# EAGLE design thing-plus-carrier (EAGLE 9.6.2)
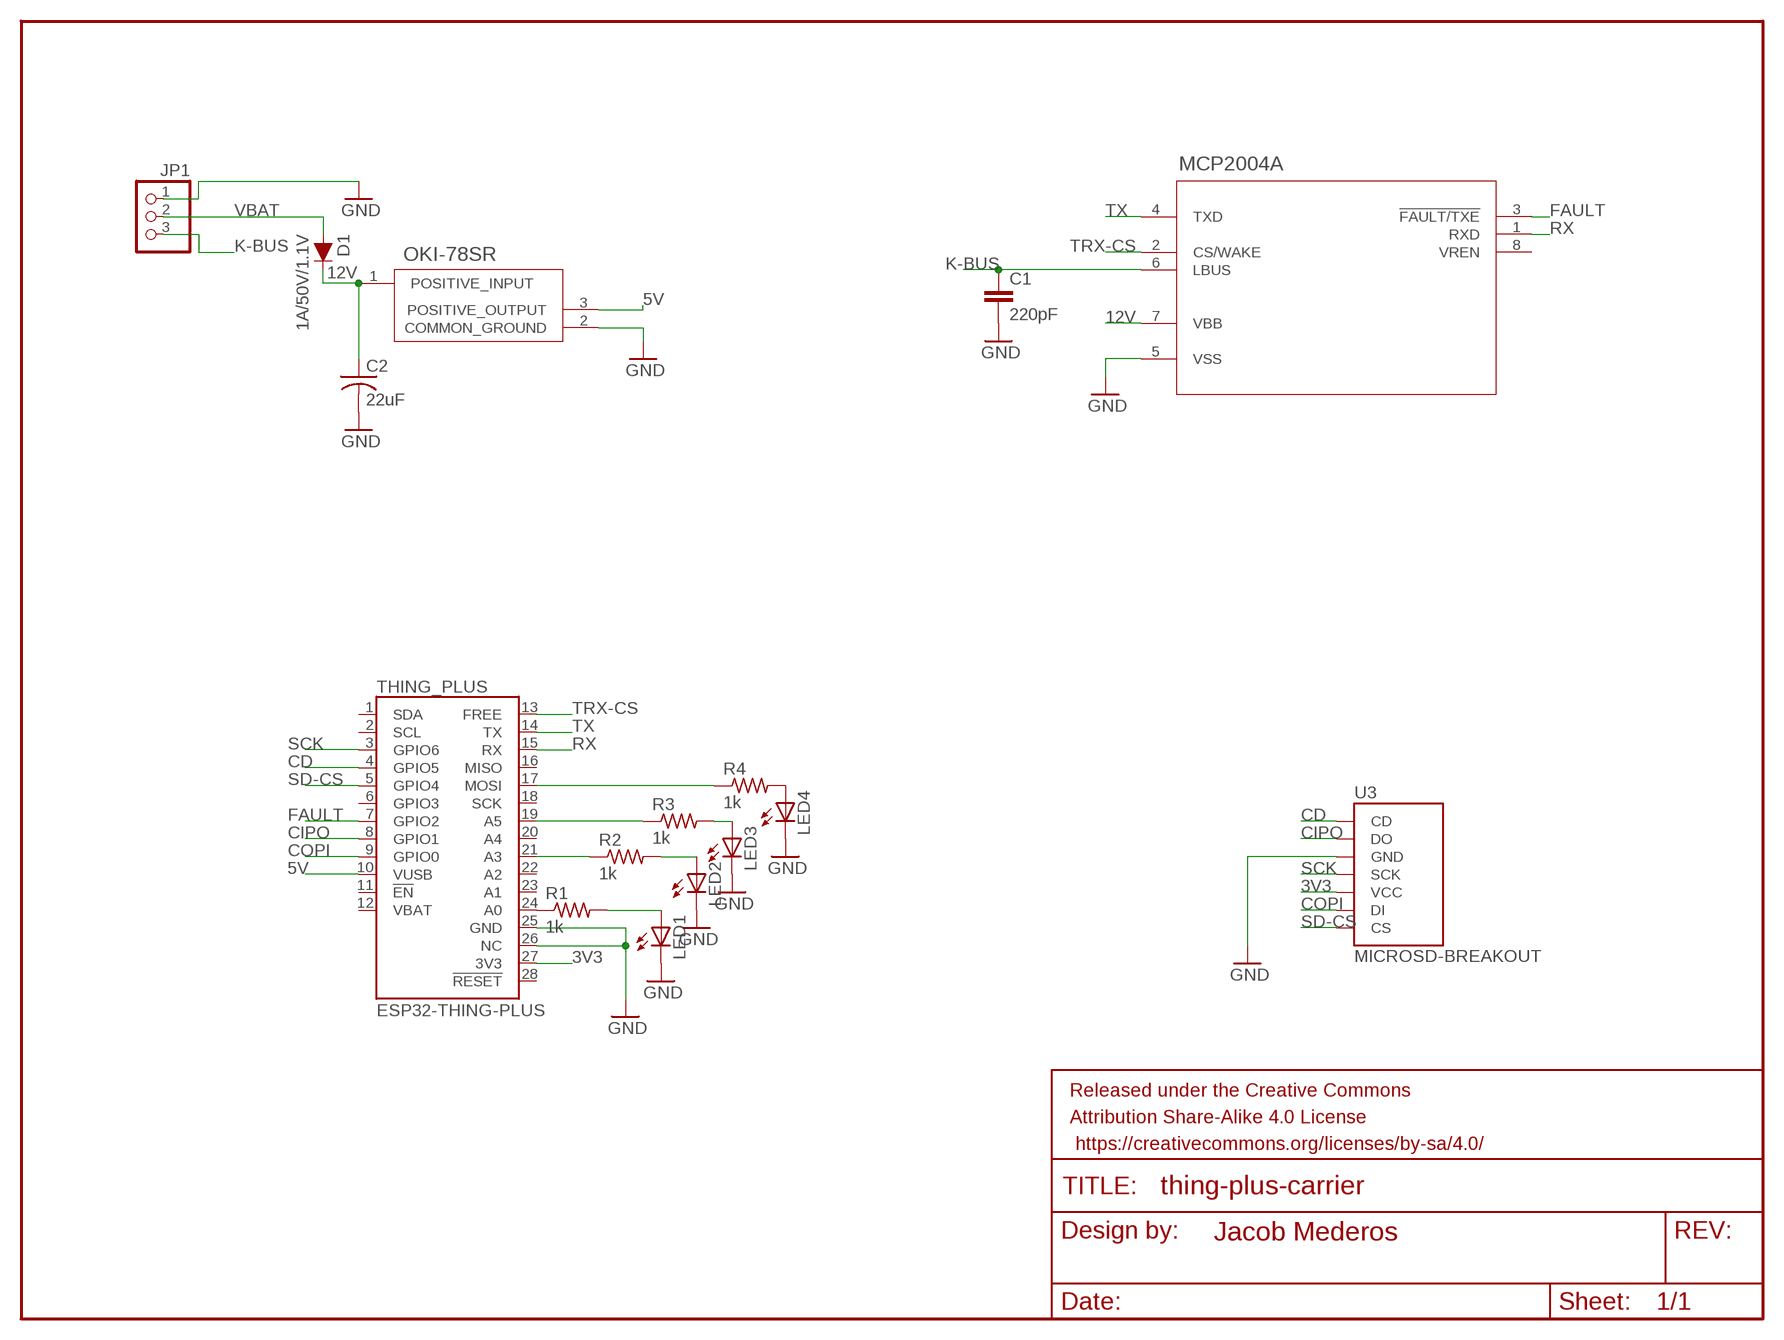
[diagram p0: schematic, sheet 1]

## Parts
C1  220pF  0.1UF-KIT-EZ-50V-20%  [CAP-PTH-SMALL-KIT]
C2  22uF  C-USC1206K  [C1206K]
D1  1A/50V/1.1V  DIODE-PTH  [DIODE-1N4001]
ESP32-THING-PLUS  THING_PLUS  [THING_PLUS]
FRAME1  FRAME-LETTERNO_PACKAGE  [DUMMY]
JP1  PINHD-1X3  [1X03]
LED1  LEDCHIPLED_0805  [CHIPLED_0805]
LED2  LEDCHIPLED_0805  [CHIPLED_0805]
LED3  LEDCHIPLED_0805  [CHIPLED_0805]
LED4  LEDCHIPLED_0805  [CHIPLED_0805]
MCP2004A  MCP2004A-E/SNSOIC8_4P9X3P9MC_MCH-M  [SOIC8_4P9X3P9MC_MCH-M]
OKI-78SR  OKI-78SR-5/1.5-W36H-C  [OKI-78SR-5/1.5-W36H-C_MUR]
R1  1k  R-US_R0805  [R0805]
R2  1k  R-US_R0805  [R0805]
R3  1k  R-US_R0805  [R0805]
R4  1k  R-US_R0805  [R0805]
U3  MICROSD-BREAKOUT  [MICROSD-BREAKOUT]

## Nets
3V3: ESP32-THING-PLUS.27(3V3) U3.VCC
5V: ESP32-THING-PLUS.10(VUSB) OKI-78SR.3(POSITIVE_OUTPUT)
12V: C2.1 D1.C MCP2004A.7(VBB) OKI-78SR.1(POSITIVE_INPUT)
CD: ESP32-THING-PLUS.4(GPIO5) U3.CD
CIPO: ESP32-THING-PLUS.8(GPIO1) U3.DO
COPI: ESP32-THING-PLUS.9(GPIO0) U3.DI
FAULT: ESP32-THING-PLUS.7(GPIO2) MCP2004A.3(!FAULT/TXE)
GND: C1.2 C2.2 ESP32-THING-PLUS.25(GND) ESP32-THING-PLUS.26(NC) JP1.1 LED1.C LED2.C LED3.C LED4.C MCP2004A.5(VSS) OKI-78SR.2(COMMON_GROUND) U3.GND
K-BUS: C1.1 JP1.3 MCP2004A.6(LBUS)
N$1: ESP32-THING-PLUS.19(A5) R3.1
N$2: ESP32-THING-PLUS.24(A0) R1.1
N$3: ESP32-THING-PLUS.21(A3) R2.1
N$4: ESP32-THING-PLUS.17(MOSI) R4.1
N$5: LED4.A R4.2
N$6: LED3.A R3.2
N$7: LED2.A R2.2
N$8: LED1.A R1.2
RX: ESP32-THING-PLUS.15(RX) MCP2004A.1(RXD)
SCK: ESP32-THING-PLUS.3(GPIO6) U3.SCK
SD-CS: ESP32-THING-PLUS.5(GPIO4) U3.CS
TRX-CS: ESP32-THING-PLUS.13(FREE) MCP2004A.2(CS/WAKE)
TX: ESP32-THING-PLUS.14(TX) MCP2004A.4(TXD)
VBAT: D1.A JP1.2
Unconnected: ESP32-THING-PLUS.1(SDA) ESP32-THING-PLUS.2(SCL) ESP32-THING-PLUS.6(GPIO3) ESP32-THING-PLUS.11(!EN) ESP32-THING-PLUS.12(VBAT) ESP32-THING-PLUS.16(MISO) ESP32-THING-PLUS.18(SCK) ESP32-THING-PLUS.20(A4) ESP32-THING-PLUS.22(A2) ESP32-THING-PLUS.23(A1) ESP32-THING-PLUS.28(!RESET) MCP2004A.8(VREN)

## Library data of the parts
C1 = SparkFun-Capacitors:0.1UF: 0.1µF ceramic capacitors A capacitor is a passive two-terminal electrical component used to store electrical energy temporarily in an electric field.; PROD_ID: CAP-08370; VALUE: 0.1uF
C2 = adafruit:C-US: CAPACITOR, American symbol
D1 = SparkFun-DiscreteSemi:DIODE: Diode These are standard reverse protection diodes and small signal diodes. SparkFun Products: SparkFun SparkPunk Sound Kit <https://www.sparkfun.com/products/11177> SparkFun ESP8266 Thing <https://www.sparkfun.com/products/13231>; PROD_ID: DIO-09176
ESP32-THING-PLUS = SparkFun-Boards:THING_PLUS
FRAME1 = SparkFun-Aesthetics:FRAME-LETTER: Schematic Frame - Letter Standard 8.5x11 US Letter frame; DESIGNER: Jacob Mederos; VERSION: v01
JP1 = kbus-feather-carrier-bom:PINHD-1X3: PIN HEADER
LED1-LED4 = adafruit:LED: LED OSRAM: - CHIPLED LG R971, LG N971, LY N971, LG Q971, LY Q971, LO R971, LY R971 LH N974, LH R974 LS Q976, LO Q976, LY Q976 LO Q996 - Hyper CHIPLED LW Q18S LB Q993, LB Q99A, LB R99A - SideLED LS A670, LO A670, LY A670, LG A670, LP A670 LB A673, LV A673, LT A673, LW A673 LH A674 LY A675 LS A676, LA A676, LO A676, LY A676, LW A676 LS A679, LY A679, LG A679 - Hyper Micro SIDELED® LS Y876, LA Y876, LO Y876, LY Y876 LT Y87S - SmartLED LW L88C, LW L88S LB L89C, LB L89S, LG L890 LS L89K, LO L89K, LY L89K LS L896, LA L896, LO L896, LY L896 - TOPLED LS T670, LO T670, LY T670, LG T670, LP T670 LSG T670, LSP T670, LSY T670, LOP T670, LYG T670 LG T671, LOG T671, LSG T671 LB T673, LV T673, LT T673, LW T673 LH T674 LS T676, LA T676, LO T676, LY T676, LB T676, LH T676, LSB T676, LW T676 LB T67C, LV T67C, LT T67C, LS T67K, LO T67K, LY T67K, LW E67C LS E67B, LA E67B, LO E67B, LY E67B, LB E67C, LV E67C, LT E67C LW T67C LS T679, LY T679, LG T679 LS T770, LO T770, LY T770, LG T770, LP T770 LB T773, LV T773, LT T773, LW T773 LH T774 LS E675, LA E675, LY E675, LS T675 LS T776, LA T776, LO T776, LY T776, LB T776 LHGB T686 LT T68C, LB T68C - Hyper Mini TOPLED® LB M676 - Mini TOPLED Santana® LG M470 LS M47K, LO M47K, LY M47K Source: http://www.osram.convergy.de/
MCP2004A = kbus-feather-carrier-bom:MCP2004A-E/SN; BUILT_BY: EMA_Jessica; COPYRIGHT: Copyright (C) 2018 Accelerated Designs. All rights reserved; MANUFACTURER_PART_NUMBER: MCP2004A-E/SN; SOURCELIBRARY: Microchip_2019-08-23_21; VENDOR: Microchip
OKI-78SR = kbus-feather-carrier-bom:OKI-78SR-5/1.5-W36H-C; BUILT_BY: EMA_Cory; COPYRIGHT: Copyright (C) 2018 Accelerated Designs. All rights reserved; MANUFACTURER_PART_NUMBER: OKI-78SR-5/1.5-W36H-C; SOURCELIBRARY: Murata_2020-01-23; VENDOR: Murata
R1-R4 = adafruit:R-US_: RESISTOR, American symbol
U3 = kbus-feather-carrier-bom:MICROSD-BREAKOUT

## Board
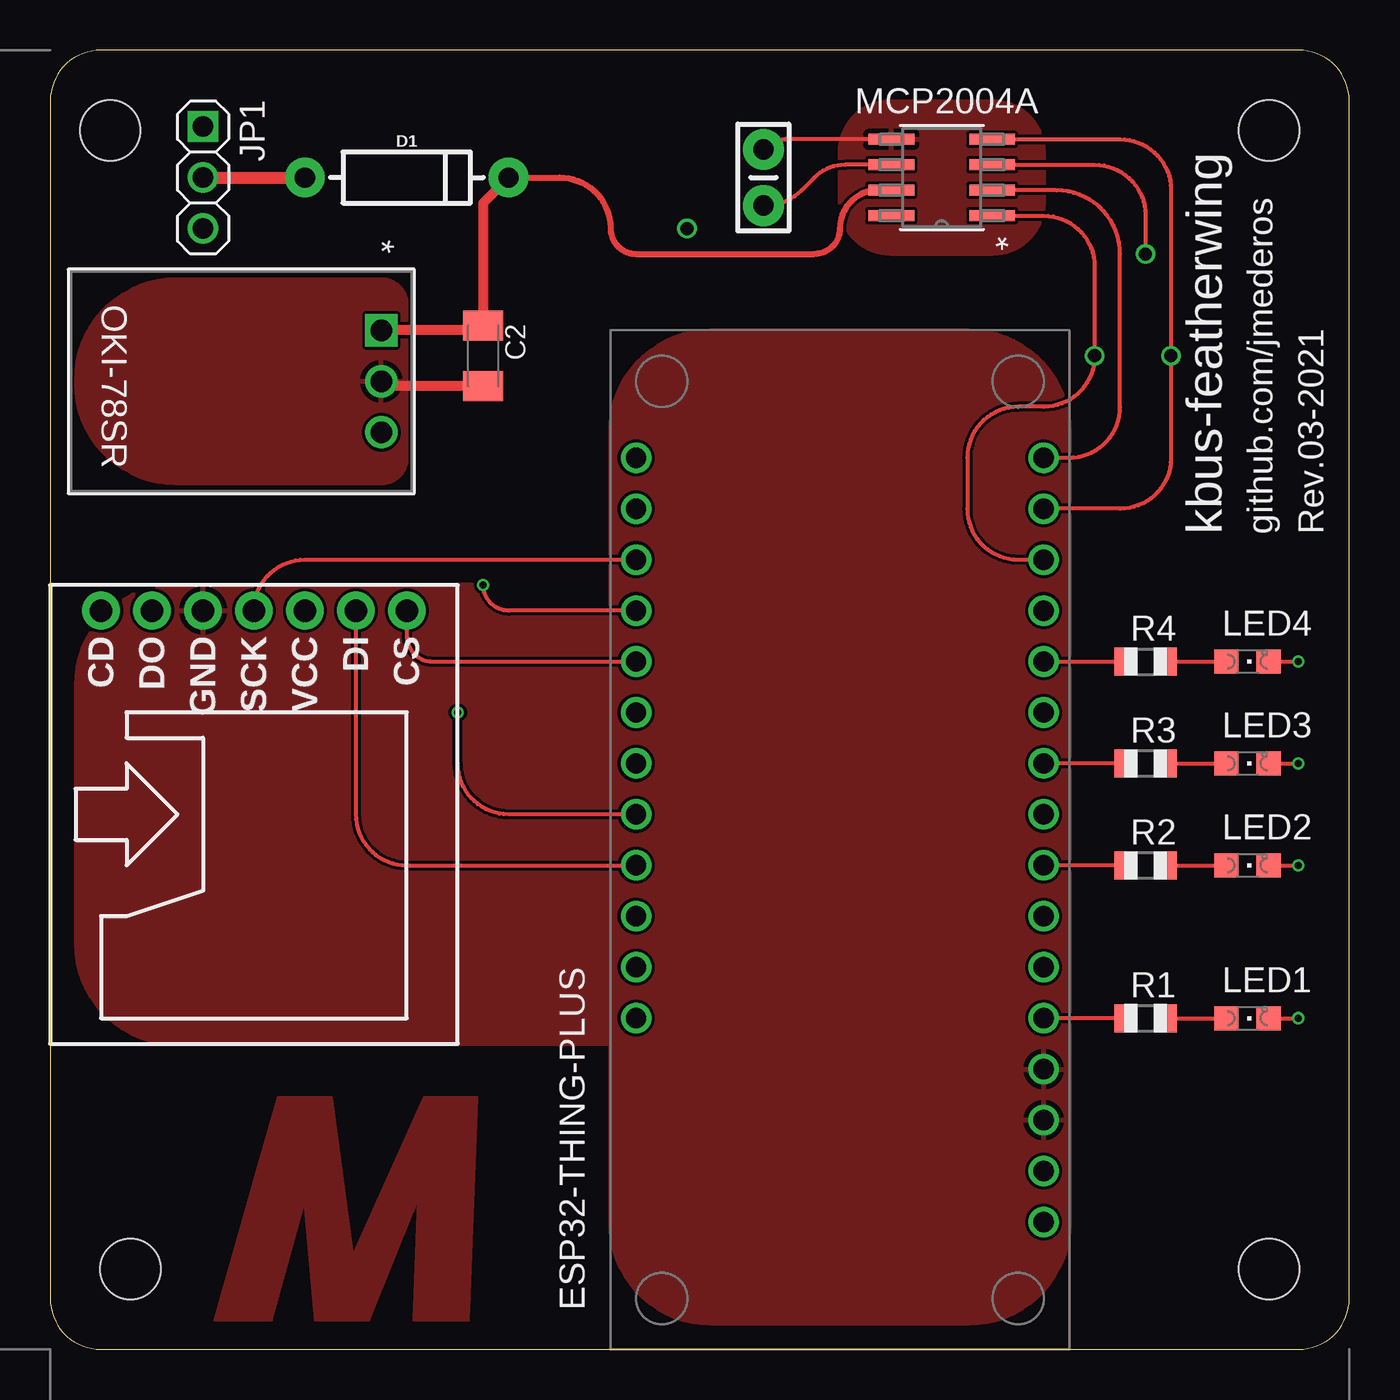
[diagram p1: board, top side]
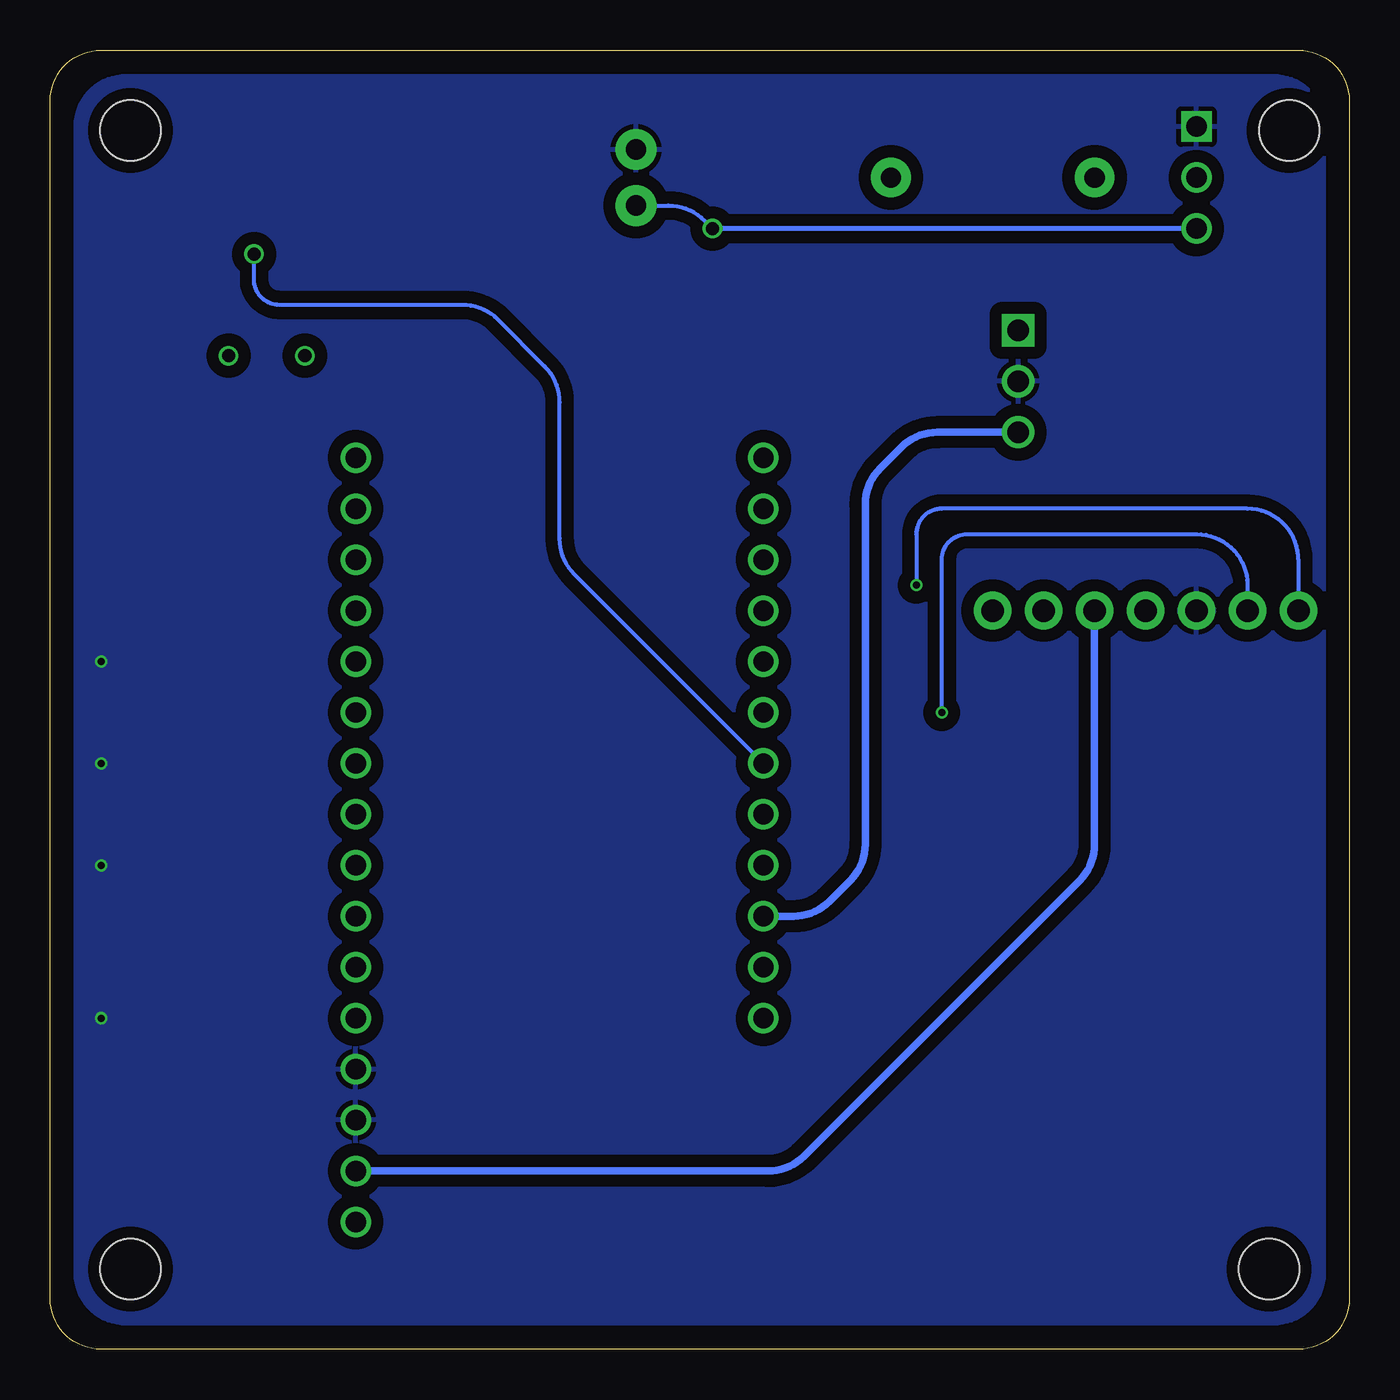
[diagram p2: board, bottom side, seen from below]

Size 64.77 x 64.77 mm. Coordinates in mm from the lower left corner, seen from the top.
Outline: 0,62.23 0,2.54 arc90 2.54,0 62.23,0 arc90 64.77,2.54 64.77,62.23 arc90 62.23,64.77 2.54,64.77 arc90 0,62.23
Copper layers (1*16): Top 0.035559375mm / dielectric 1.6mm / Bottom 0.035559375mm
Design rules "oshpark-2layer *": minimum track width 6mil, minimum drill 10mil, track to track 6mil, track to pad 6mil, pad to pad 6mil, via to via 6mil, smd to smd 6mil, copper to edge 15mil, drill to drill 6mil, minimum pad ring 5mil, minimum via ring 5mil, stop-mask expansion 2.5mil, vias tented up to drill 20mil, thermal gap 10mil
Holes 3 mm at 4,4 60.77,4 60.77,60.77 3,60.77

### Footprints (pad centres in the part's own frame; a part is rotated, then mirrored left to right if it is on the bottom)
CAP-PTH-SMALL-KIT = drill 1.016 pad 2.032: 1 -1.397,0; 2 1.397,0
C1206K = smd 1.5 x 2: 1 -1.5,0; 2 1.5,0
DIODE-1N4001 = drill 1 pad 1.981: A -5.08,0; C 5.08,0
THING_PLUS = drill 1.016: 1 -10.16,19.05; 2 -10.16,16.51; 3 -10.16,13.97; 4 -10.16,11.43; 5 -10.16,8.89; 6 -10.16,6.35; 7 -10.16,3.81; 8 -10.16,1.27; 9 -10.16,-1.27; 10 -10.16,-3.81; 11 -10.16,-6.35; 12 -10.16,-8.89; 13 10.16,19.05; 14 10.16,16.51; 15 10.16,13.97; 16 10.16,11.43; 17 10.16,8.89; 18 10.16,6.35; 19 10.16,3.81; 20 10.16,1.27; 21 10.16,-1.27; 22 10.16,-3.81; 23 10.16,-6.35; 24 10.16,-8.89; 25 10.16,-11.43; 26 10.16,-13.97; 27 10.16,-16.51; 28 10.16,-19.05
1X03 = drill 1.016 square: 1 -2.54,0 | drill 1.016: 2 0,0; 3 2.54,0
CHIPLED_0805 = smd 1.2 x 1.2: A 0,-1.05; C 0,1.05
SOIC8_4P9X3P9MC_MCH-M = smd 2.286 x 0.559: 1 -2.515,1.905; 2 -2.515,0.635; 3 -2.515,-0.635; 4 -2.515,-1.905; 5 2.515,-1.905; 6 2.515,-0.635; 7 2.515,0.635; 8 2.515,1.905
OKI-78SR-5/1.5-W36H-C_MUR = drill 1.067 pad 1.575 square: 1 0,0 | drill 1.067 pad 1.575: 2 2.54,0; 3 5.08,0
R0805 = smd 1.1 x 1.4: 1 -1,0; 2 1,0
MICROSD-BREAKOUT = drill 1.118 pad 1.88: CD 12.7,8.89; CS 12.7,-6.35; DI 12.7,-3.81; DO 12.7,6.35; GND 12.7,3.81; SCK 12.7,1.27; VCC 12.7,-1.27

### Placement (x,y rotation side)
C1  35.56,58.42 90 top
C2  21.59,49.53 270 top
D1  17.78,58.42 0 top
ESP32-THING-PLUS  39.37,25.4 0 top
FRAME1  -12.7,3.81 0 top  (outside the outline)
JP1  7.62,58.42 270 top
LED1  59.69,16.51 270 top
LED2  59.69,24.13 270 top
LED3  59.69,29.21 270 top
LED4  59.69,34.29 270 top
MCP2004A  44.45,58.42 180 top
OKI-78SR  16.51,50.8 270 top
R1  54.61,16.51 0 top
R2  54.61,24.13 0 top
R3  54.61,29.21 0 top
R4  54.61,34.29 0 top
U3  11.43,24.13 90 top

### Tracks (layer width: path | path; a pad name or v marks a point on that pad's centre or on a via)
3V3
  Bottom 0.381: U3.VCC 12.7,25.18 arc45 13.44,23.39 27.2,9.63 arc45 28.99,8.89 ESP32-THING-PLUS.27
5V
  Bottom 0.381: OKI-78SR.3 20.54,45.72 arc-45 22.33,44.98 23.39,43.92 arc-45 24.13,42.13 24.13,25.18 arc45 24.87,23.39 25.93,22.33 arc45 27.72,21.59 ESP32-THING-PLUS.10
12V
  Top 0.203: MCP2004A.7 41.27,57.78
  Top 0.305: 41.27,57.78 arc90 39.37,55.88 arc-90 38.1,54.61 29.21,54.61 arc-90 27.94,55.88 arc90 25.4,58.42 D1.C
  Top 0.406: C2.1 arc-90 21.48,50.91
  Top 0.508: D1.C 21.59,57.15 C2.1 | C2.1 21.48,50.91 | C2.1 21.36,50.8 OKI-78SR.1
CD  (via drill 0.35)
  Top 0.203: ESP32-THING-PLUS.4 22.86,36.83 arc-90 v21.59,38.1
  Bottom 0.203: U3.CD 2.54,39.37 arc-90 5.08,41.91 20.32,41.91 arc-90 21.59,40.64 v21.59,38.1
CIPO  (via drill 0.35)
  Top 0.203: ESP32-THING-PLUS.8 22.86,26.67 arc-90 20.32,29.21 v20.32,31.75
  Bottom 0.203: v20.32,31.75 20.32,39.37 arc90 19.05,40.64 7.62,40.64 arc90 5.08,38.1 U3.DO
COPI
  Top 0.203: ESP32-THING-PLUS.9 17.78,24.13 arc-90 15.24,26.67 U3.DI
FAULT  (via drill 0.65)
  Top 0.203: MCP2004A.3 52.07,59.05 arc-90 54.61,56.52 v54.61,54.61
  Bottom 0.203: v54.61,54.61 54.61,53.34 arc-90 53.34,52.07 44.23,52.07 arc45 42.44,51.33 40.11,49 arc45 39.37,47.21 39.37,40.42 arc-45 38.63,38.63 ESP32-THING-PLUS.7
GND  (via drill 0.35)
  Top 0.203: LED4.C v62.23,34.29 | LED3.C v62.23,29.21 | LED2.C v62.23,24.13 | LED1.C v62.23,16.51 | MCP2004A.5 36.79,60.33 arc45 C1.2
  Top 0.406: OKI-78SR.2 16.74,48.03
  Top 0.508: C2.2 16.74,48.03
  pour Bottom (isolate 0.61): 60.96,63.5 3.81,63.5 arc90 1.27,60.96 1.27,3.81 arc90 3.81,1.27 60.96,1.27 arc90 63.5,3.81 63.5,60.96 arc90
  pour Top: 45.8,1.27 32.94,1.27 arc-90 27.94,6.27 27.94,45.8 arc-90 32.94,50.8 45.8,50.8 arc-90 50.8,45.8 50.8,6.27 arc-90
  pour Top: 27.94,38.1 6.27,38.1 arc90 1.27,33.1 1.27,20.24 arc90 6.27,15.24 27.94,15.24
  pour Top: 1.27,48.34 1.27,48.18 arc90 6.27,43.18 16.51,43.18 arc90 17.78,44.45 17.78,52.07 arc90 16.51,53.34 6.27,53.34 arc90
  pour Top: 39.37,57.15 39.37,59.69 arc-90 41.91,62.23 46.99,62.23 arc-90 49.53,59.69 49.53,57.15 arc-90 46.99,54.61 41.91,54.61 arc-90
K-BUS  (via drill 0.65)
  Top 0.203: MCP2004A.6 39.63,59.05 arc45 38.1,58.42 37.45,57.77 arc-45 35.65,57.02 C1.1
  Bottom 0.203: C1.1 33.95,57.02 arc45 32.15,56.28 v31.75,55.88
  Bottom 0.254: JP1.3 v31.75,55.88
N$1
  Top 0.203: R3.1 ESP32-THING-PLUS.19
N$2
  Top 0.203: R1.1 ESP32-THING-PLUS.24
N$3
  Top 0.203: R2.1 ESP32-THING-PLUS.21
N$4
  Top 0.203: ESP32-THING-PLUS.17 R4.1
N$5
  Top 0.203: R4.2 LED4.A
N$6
  Top 0.203: R3.2 LED3.A
N$7
  Top 0.203: R2.2 LED2.A
N$8
  Top 0.203: R1.2 LED1.A
N$9
  pour Top: 9.9,7.5 8.18,1.45 11.05,1.45 12.66,7.31 13.19,1.45 15.91,1.45 18.33,7.43 18.09,1.45 20.89,1.45 21.32,12.55 18.63,12.55 15.1,4.75 14.05,12.55 11.33,12.55 10.2,8.57
RX  (via drill 0.65)
  Top 0.203: MCP2004A.1 49.53,56.52 arc-90 52.07,53.98 v52.07,49.53 arc-90 49.53,46.99 48.26,46.99 arc90 45.72,44.45 45.72,41.91 arc90 48.26,39.37 ESP32-THING-PLUS.15
SCK
  Top 0.203: U3.SCK arc-90 12.7,39.37 ESP32-THING-PLUS.3
SD-CS
  Top 0.203: U3.CS 17.78,35.56 arc90 19.05,34.29 ESP32-THING-PLUS.5
TRX-CS
  Top 0.203: ESP32-THING-PLUS.13 50.8,44.45 arc90 53.34,46.99 53.34,54.61 arc90 50.16,57.78 MCP2004A.2
TX  (via drill 0.65)
  Top 0.203: MCP2004A.4 53.34,60.33 arc-90 55.88,57.78 v55.88,49.53 55.88,44.45 arc-90 53.34,41.91 ESP32-THING-PLUS.14
VBAT
  Top 0.61: JP1.2 D1.A

### Text on the board
tPlace: kbus-featherwing | github.com/jmederos | Rev.03-2021